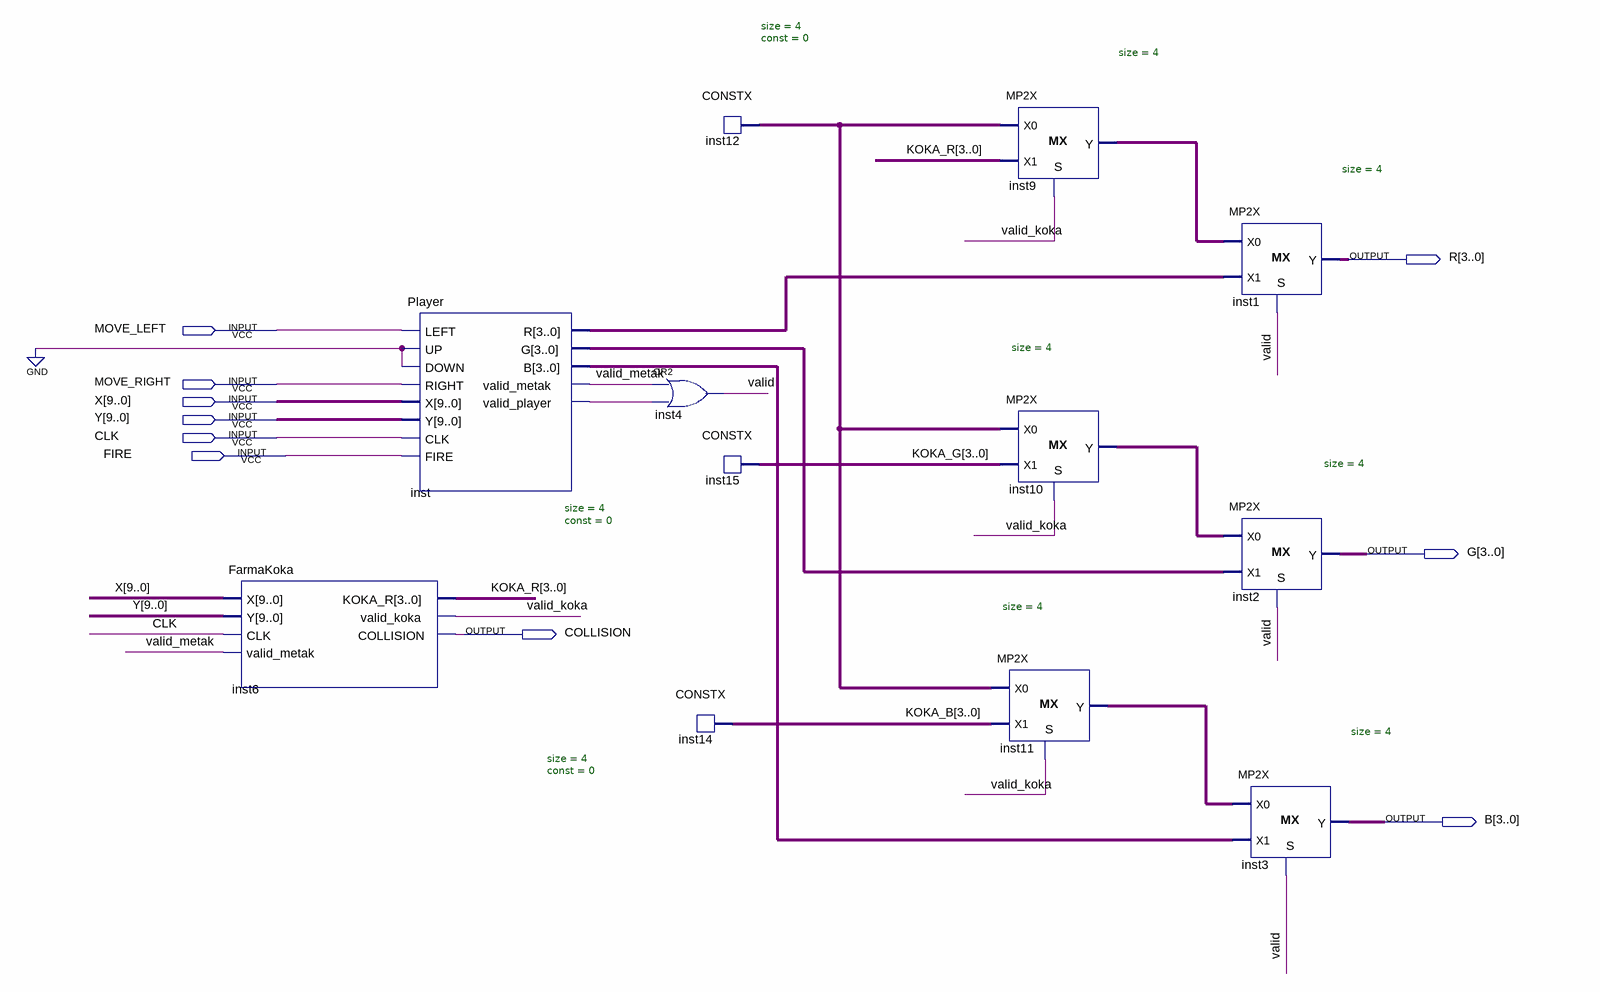
[diagram p0: schematic sheet]
// Quartus schematic Game.bdf as structural Verilog: 12 symbols, 10 pins
module Game (
  input  MOVE_LEFT,
  input  MOVE_RIGHT,
  input  [9:0] X,
  input  [9:0] Y,
  input  CLK,
  input  FIRE,
  output [3:0] R,
  output [3:0] G,
  output COLLISION,
  output [3:0] B
);

  wire inst_valid_player, valid, valid_koka, valid_metak;
  wire [3:0] inst9_y, inst10_y, inst11_y, inst12_data, inst_b, inst_g, inst_r, KOKA_B, KOKA_G, KOKA_R;

  FarmaKoka inst6 (
    .X(X), .Y(Y), .CLK(CLK), .valid_metak(valid_metak), .KOKA_R(KOKA_R), .valid_koka(valid_koka),
    .COLLISION(COLLISION));
  Player inst (
    .LEFT(MOVE_LEFT), .UP(1'b0), .DOWN(1'b0), .RIGHT(MOVE_RIGHT), .X(X), .Y(Y), .CLK(CLK), .FIRE(FIRE),
    .R(inst_r), .G(inst_g), .B(inst_b), .valid_metak(valid_metak), .valid_player(inst_valid_player));
  CONSTX #(.size(4), .\const (0)) inst12 (.data(inst12_data));
  or inst4 (valid, valid_metak, inst_valid_player);
  CONSTX #(.size(4), .\const (0)) inst15 (.data(KOKA_G));
  CONSTX #(.size(4), .\const (0)) inst14 (.data(KOKA_B));
  MP2X #(.size(4)) inst11 (.S(valid_koka), .X0(inst12_data), .X1(KOKA_B), .Y(inst11_y));
  MP2X #(.size(4)) inst9 (.S(valid_koka), .X0(inst12_data), .X1(KOKA_R), .Y(inst9_y));
  MP2X #(.size(4)) inst10 (.S(valid_koka), .X0(inst12_data), .X1(KOKA_G), .Y(inst10_y));
  MP2X #(.size(4)) inst1 (.S(valid), .X0(inst9_y), .X1(inst_r), .Y(R));
  MP2X #(.size(4)) inst2 (.S(valid), .X0(inst10_y), .X1(inst_g), .Y(G));
  MP2X #(.size(4)) inst3 (.S(valid), .X0(inst11_y), .X1(inst_b), .Y(B));
endmodule
